# Altium schematic sheet Interfaces.SchDoc
size A4
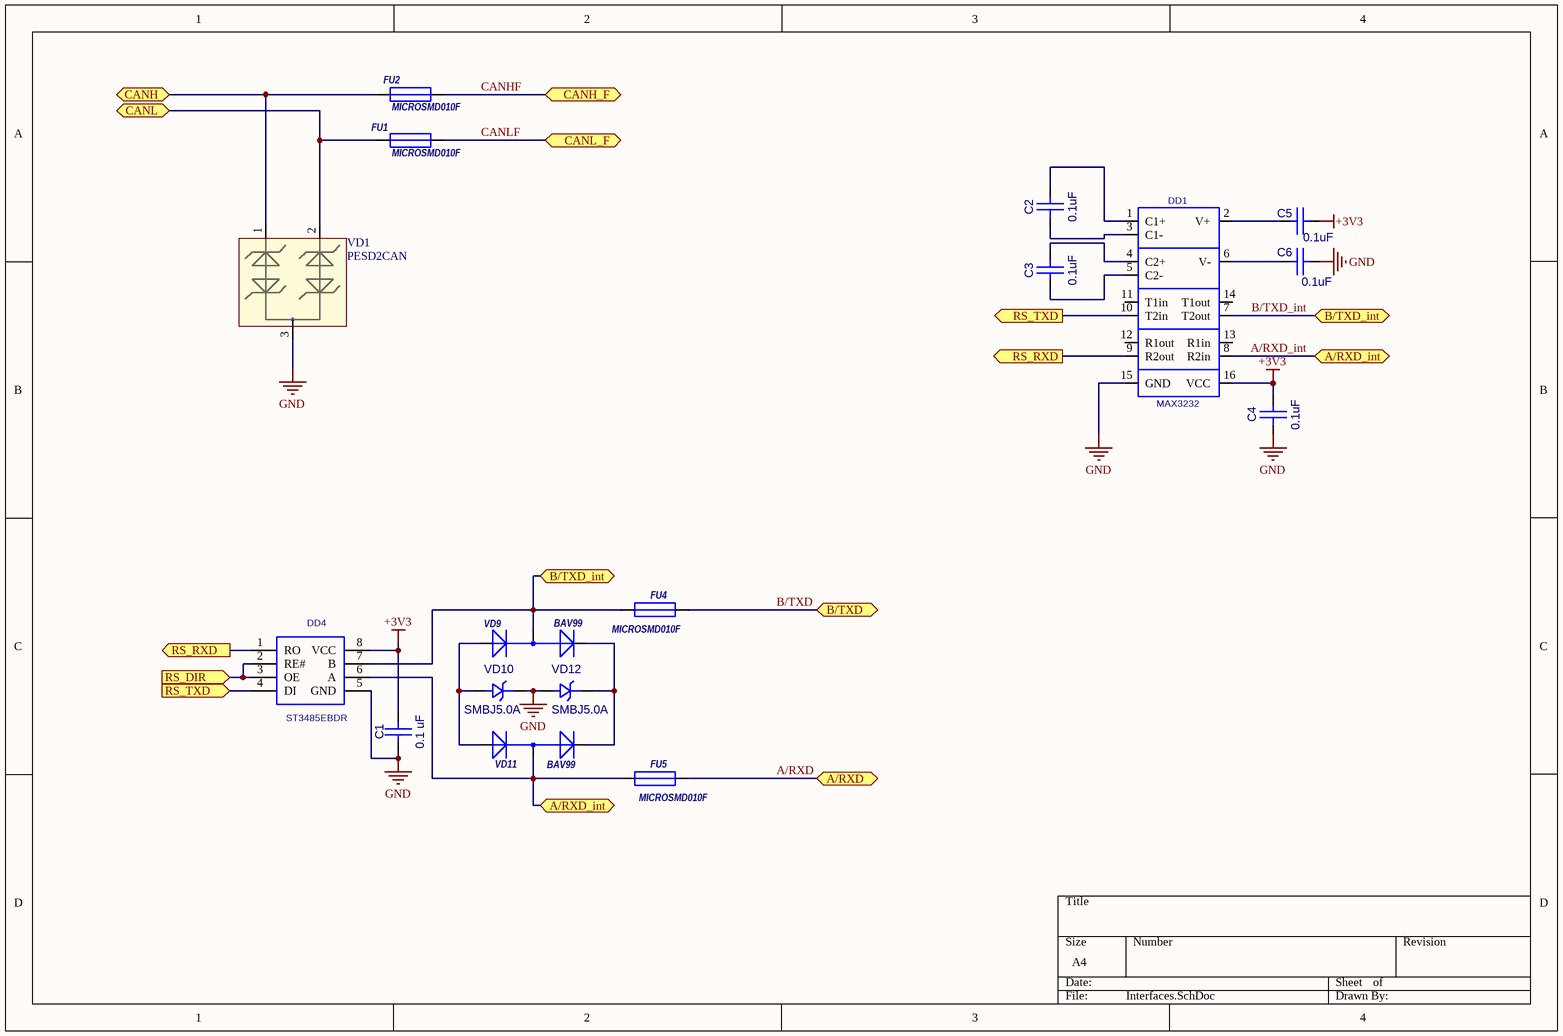
[diagram p0: Interfaces.SchDoc]

## Parts
C1  0.1 uF  [CC0603-3M]
C2  0.1uF  [CC0603-3M]
C3  0.1uF  [CC0603-3M]
C4  0.1uF  [CC0603-3M]
C5  0.1uF  [CC0603-3M]
C6  0.1uF  [CC0603-3M]
DD1  MAX3232  [SO16_M]
DD4  ST3485EBDR  [SO-8]
FU1  MICROSMD010F  [RC1210]
FU2  MICROSMD010F  [RC1210]
FU4  MICROSMD010F  [RC1210]
FU5  MICROSMD010F  [RC1210]
VD1  PESD2CAN  [SOT-23(123)]
VD9  BAV99  [SOT-23(GSD)]
VD10  SMBJ5.0A  [SMB]
VD11  BAV99  [SOT-23(GSD)]
VD12  SMBJ5.0A  [SMB]

## Ports
A/RXD, A/RXD_int, B/TXD, B/TXD_int, CANH, CANH_F, CANL, CANL_F, RS_DIR (in), RS_RXD (out), RS_TXD (in), RS_TXD (out)

## Nets
+3V3: C1.2(B) C4.2(B) C5.1(A) DD1.16(VCC) DD4.8(VCC)
GND: C1.1(A) C4.1(A) C6.1(A) DD1.15(GND) DD4.5(GND) VD1.3 VD10.2(K) VD12.1(A)
A/RXD: FU5.1 ; port A/RXD
A/RXD_int: DD1.8(R2in) DD4.6(A) FU5.2 VD11.3(AK) ; port A/RXD_int
B/TXD: FU4.1 ; port B/TXD
B/TXD_int: DD1.7(T2out) DD4.7(B) FU4.2 VD9.3(AK) ; port B/TXD_int
CANH: FU2.1 VD1.1 ; port CANH
CANHF: FU2.2 ; port CANH_F
CANL: FU1.1 VD1.2 ; port CANL
CANLF: FU1.2 ; port CANL_F
RS_DIR: DD4.2(RE#) DD4.3(OE) ; port RS_DIR
RS_RXD: DD1.9(R2out) DD4.1(RO) ; port RS_RXD
RS_TXD: DD1.10(T2in) DD4.4(DI) ; port RS_TXD
NetC2_1: C2.1(A) DD1.3(C1-)
NetC2_2: C2.2(B) DD1.1(C1+)
NetC3_1: C3.1(A) DD1.5(C2-)
NetC3_2: C3.2(B) DD1.4(C2+)
NetC5_2: C5.2(B) DD1.2(V+)
NetC6_2: C6.2(B) DD1.6(V-)
NetVD9_1: VD9.1(A) VD10.1(A) VD11.1(A)
NetVD9_2: VD9.2(K) VD11.2(K) VD12.2(K)

Not connected (* = marked no-connect by the designer): DD1 11(T1in) 12(R1out) 13(R1in) 14(T1out)

## Library data of the parts
C1-C6 = CC0603
  C1: Value: 0.1 uF
  C2-C6: Value: 0.1uF
DD1 = ST232BD/CD: Value: MAX3232
DD4 = SP485: Value: *
FU1 FU2 FU4 FU5 = MICROSMD: Value: MICROSMD010F
VD1 = PESD2CAN: TVS for CAN
VD9 VD11 = BAV99: 1.0 Ampere General Purpose Rectifier; ComponentField6: Published 8-Jun-2000, Modified 11-July-2000: SIM Model Added.; Value: *
VD10 VD12 = SMBJ: Value: *